# EAGLE design 452_spreakerRev102 (EAGLE 9.6.0)
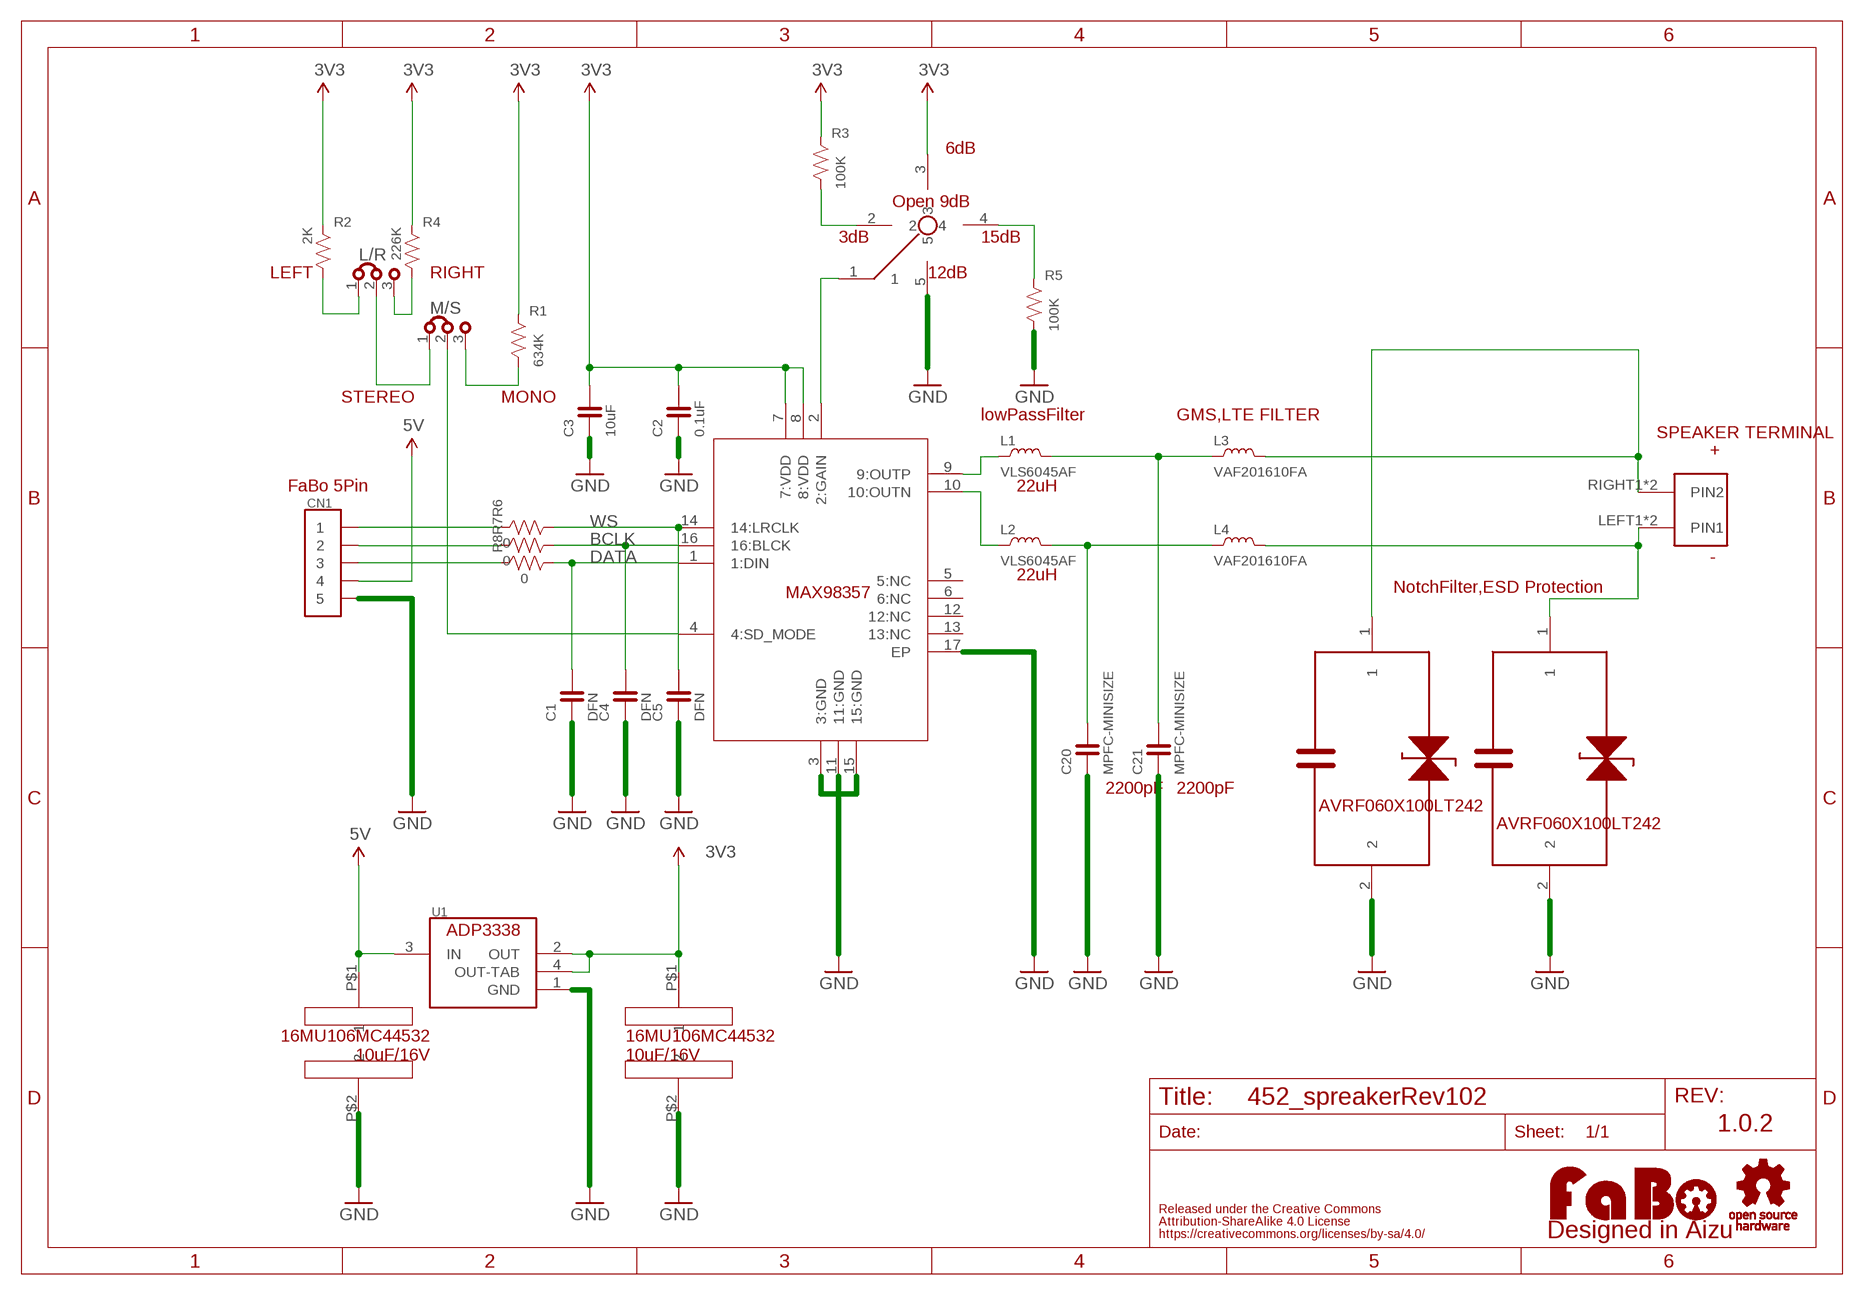
[diagram p0: schematic, sheet 1]

## Parts
C1  DFN  CAPACITOR-0603  [0603]
C2  0.1uF  CAPACITOR-0603  [0603]
C3  10uF  CAPACITOR-0603  [0603]
C4  DFN  CAPACITOR-0603  [0603]
C5  DFN  CAPACITOR-0603  [0603]
C20  MPFC-MINISIZE  [DIP-MPFC]
C21  MPFC-MINISIZE  [DIP-MPFC]
C100  POLIYMER_MULTI_LAYER_MU  [4532]
C101  POLIYMER_MULTI_LAYER_MU  [4532]
CN1  SMD-CONN-5PIN-SM05B-PASS-1  [SM05B-PASS-1]
L1  VLS6045AF  [VLS6045AF]
L2  VLS6045AF  [VLS6045AF]
L3  VAF201610FA  [VAF201610FA-1]
L4  VAF201610FA  [VAF201610FA-1]
L/R  JUMPERS_JP2-2MM  [JUMPERS_JP2-2MM]
LOGO1  LOGO_FABO-M  [LOGO_FABO_M]
M/S  JUMPERS_JP2-2MM  [JUMPERS_JP2-2MM]
R1  634K  RESISTOR-0603  [0603]
R2  2K  RESISTOR-0603  [0603]
R3  100K  RESISTOR-0603  [0603]
R4  226K  RESISTOR-0603  [0603]
R5  100K  RESISTOR-0603  [0603]
R6  0  RESISTOR-0603  [0603]
R7  0  RESISTOR-0603  [0603]
R8  0  RESISTOR-0603  [0603]
U1  ADP3338AKCZ  [SOT-223-KC3]
U$2  MAX98357A,B  [TQFN(16L3*3*0.75)]
U$3  2MMJUMPER_CROSS  [PINHEAD2MM_CROSS]
U$4  ML-1400-S1  [ML-1400-S1]
U$5  AVRF060X100LT242  [AVRF0X0X100LT_0603]
U$6  AVRF060X100LT242  [AVRF0X0X100LT_0603]
U$10  LOGO_OSHW-M_BOTTOM  [LOGO_OSHW_M_BOTTOM]

## Nets
3DB: R3.2 U$3.2
3V3: C2.2 C3.2 C101.P$1 R1.1 R2.1 R3.1 R4.1 U1.2(OUT) U1.4(OUT-TAB) U$2.7(7:VDD) U$2.8(8:VDD) U$3.3
5V: C100.P$1 CN1.4 U1.3(IN)
15DB: R5.1 U$3.4
BCLK: C4.2 R7.2 U$2.16(16:BLCK)
DATA: C1.2 R8.2 U$2.1(1:DIN)
GAIN: U$2.2(2:GAIN) U$3.1
GND: C1.1 C2.1 C3.1 C4.1 C5.1 C20.1 C21.1 C100.P$2 C101.P$2 CN1.5 R5.2 U1.1(GND) U$2.3(3:GND) U$2.11(11:GND) U$2.15(15:GND) U$2.17(EP) U$3.5 U$5.2 U$6.2
LEFT: L/R.1 R2.2
MONO: M/S.3 R1.2
MS: M/S.2 U$2.4(4:SD_MODE)
N$1: L2.1 U$2.10(10:OUTN)
N$2: L1.1 U$2.9(9:OUTP)
N$3: L4.2 U$4.LEFT1(PIN1) U$4.LEFT2(PIN1) U$6.1
N$5: CN1.1 R6.1
N$9: L3.2 U$4.RIGHT1(PIN2) U$4.RIGHT2(PIN2) U$5.1
N$12: CN1.2 R7.1
N$13: CN1.3 R8.1
N$14: C21.2 L1.2 L3.1
N$15: C20.2 L2.2 L4.1
RIGHT: L/R.3 R4.2
STEREO: L/R.2 M/S.1
WS: C5.2 R6.2 U$2.14(14:LRCLK)
Unconnected: U$2.5(5:NC) U$2.6(6:NC) U$2.12(12:NC) U$2.13(13:NC)

## Notes on the sheet
- 6dB
- Open 9dB
- 3dB | 15dB
- LEFT | RIGHT | 12dB
- STEREO | MONO
- lowPassFilter | GMS,LTE FILTER
- SPEAKER TERMINAL
- +
- FaBo 5Pin | 22uH
- -
- 22uH | NotchFilter,ESD Protection
- 2200pF | 2200pF
- AVRF060X100LT242
- AVRF060X100LT242
- 16MU106MC44532
  10uF/16V
- 16MU106MC44532
  10uF/16V
- 1.0.2

## Library data of the parts
C1-C5 = FaBo-Capacitor:CAPACITOR: CAPACITOR
C20 C21 = FaBo-Capacitor:MPFC-MINISIZE
C100 C101 = FaBo-Capacitor:POLIYMER_MULTI_LAYER_MU: Rubycon 16MU106MC44532 10uF/16V +-20% size 4532
CN1 = FaBo-Connetor:SMD-CONN-5PIN
L1 L2 = FaBo-Coil:VLS6045AF
L3 L4 = FaBo-Coil:VAF201610FA
L/R M/S = 52101-101-REV-A_v16:JUMPERS_JP2-: Jumper/Bridge
LOGO1 = component:LOGO_FABO
R1-R8 = FaBo-Resistors:RESISTOR: RESISTOR
U1 = FaBo-Supply:ADP3338AKCZ
U$2 = FaBo-AudioIC:MAX98357A,B
U$3 = FaBo-PIN:2MMJUMPER_CROSS
U$4 = FaBo-Terminal:ML-1400-S1
U$5 U$6 = FaBo-Coil:AVRF060X100LT242: ESD Notch Filters For wireless audio equipment TDK AVRF series ESD protection and noise protechtion.
U$10 = component:LOGO_OSHW

## Board
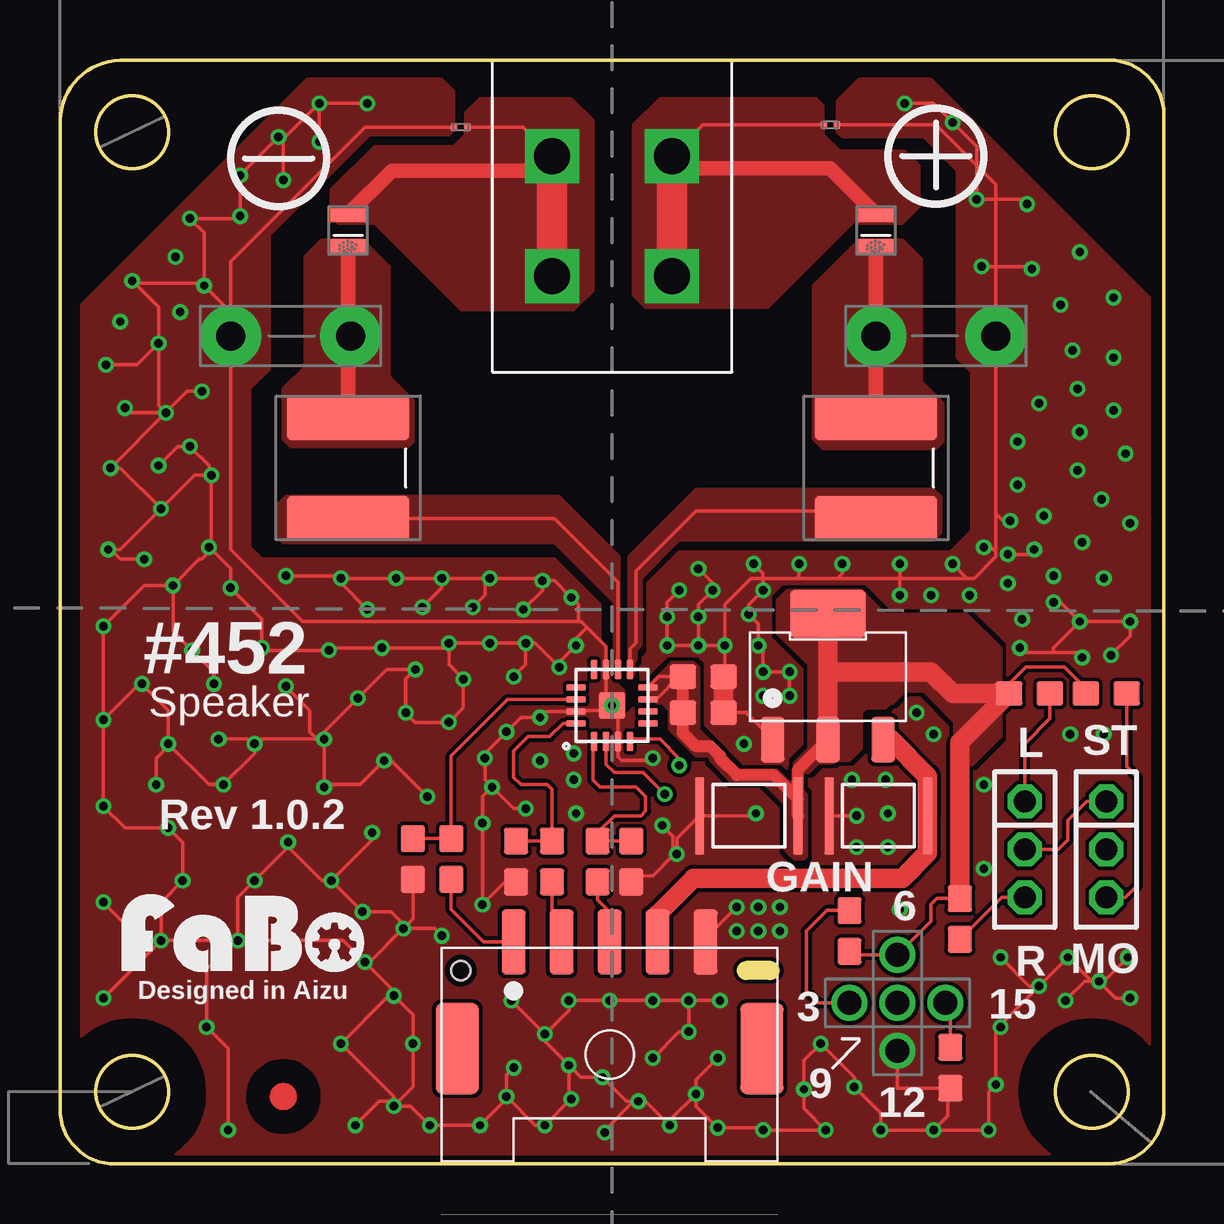
[diagram p1: board, top side]
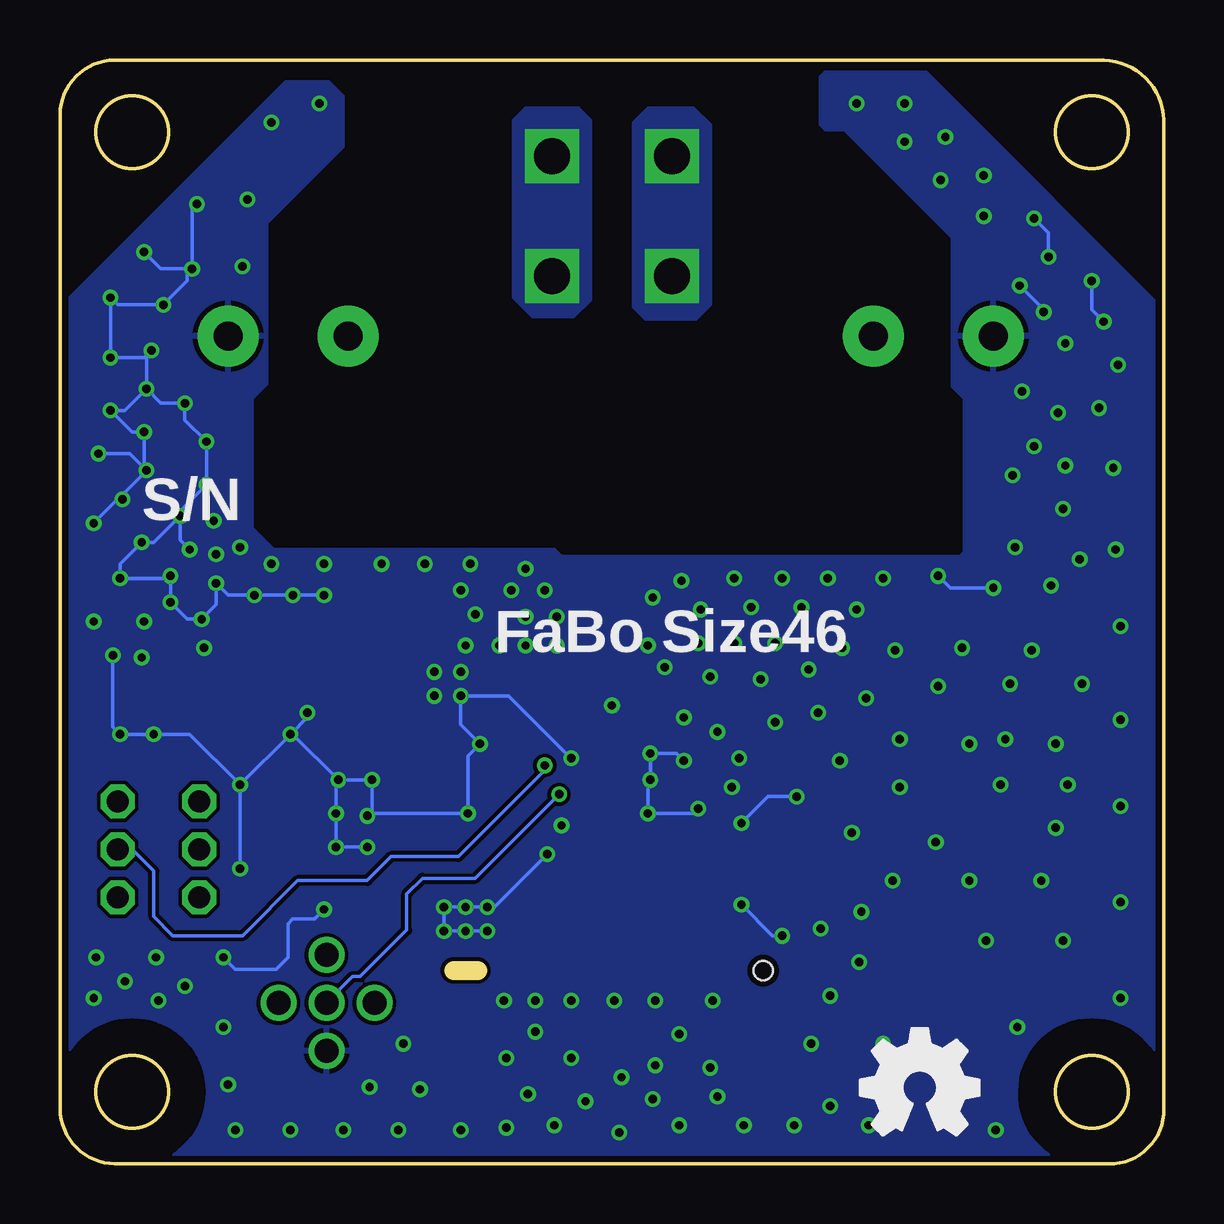
[diagram p2: board, bottom side, seen from below]

Size 46.02 x 46.02 mm. Coordinates in mm from the lower left corner, seen from the top.
Outline: 0.01,2.51 0.01,43.51 arc-87 2.51,46.01 43.51,46.01 arc-100 46.01,43.51 46.01,2.51 arc-99 43.51,0.01 2.51,0.01 arc-102 0.01,2.51
Outline: circle at 43.01,43.01 radius 1.5
Outline: circle at 3.01,43.01 radius 1.5
Outline: circle at 3.01,3.01 radius 1.5
Outline: circle at 43.01,3.01 radius 1.5
Copper layers (1*16): Top 0.035mm / dielectric 1.6mm / Bottom 0.035mm
Design rules "PCBway": minimum track width 6mil, minimum drill 12mil, track to track 6mil, track to pad 6mil, pad to pad 6mil, via to via 6mil, smd to smd 6mil, copper to edge 10mil, drill to drill 10mil, minimum pad ring 10mil, minimum via ring 6mil, stop-mask expansion 2mil, vias tented up to drill 100mil, thermal gap 8mil
tKeepout: area 27.9,32.4 to 30.6,46.6; area 40,40 to 46,46; area 0,40 to 6,46
tRestrict: area 0,0 to 6,6; area 40,0 to 46,6
bRestrict: area 0,0 to 6,6; area 40,0 to 46,6

### Footprints (pad centres in the part's own frame; a part is rotated, then mirrored left to right if it is on the bottom)
0603 = smd 1.1 x 1: 1 -0.85,0; 2 0.85,0
DIP-MPFC = drill 1.2 pad 2.54: 1 -2.5,0; 2 2.5,0
4532 = smd 0.4 x 3.2: P$1 2.05,0; P$2 -2.05,0
SM05B-PASS-1 = smd 1 x 2.7: 1 4,-11.85; 2 2,-11.85; 3 0,-11.85; 4 -2,-11.85; 5 -4,-11.85 | smd 1.8 x 3.8: P$1 6.35,-7.4; P$2 -6.35,-7.4 | hole 0.8: 6.2,-10.65
VLS6045AF = smd 1.9 x 5.1: 1 -2.1,0; 2 2.1,0
VAF201610FA-1 = smd 0.65 x 1.6: 1 -0.675,0; 2 0.675,0
JUMPERS_JP2-2MM = drill 0.914 octagon: 1 -2,0; 2 0,0; 3 2,0
SOT-223-KC3 = smd 1 x 1.9: 1 -2.3,-2.625; 2 0,-2.625; 3 2.3,-2.625 | smd 3.15 x 2: 4 0,2.625
TQFN(16L3*3*0.75) = smd 0.28 x 0.8: 1 -0.75,-1.5; 2 -0.25,-1.5; 3 0.25,-1.5; 4 0.75,-1.5; 9 0.75,1.5; 10 0.25,1.5; 11 -0.25,1.5; 12 -0.75,1.5 | smd 0.8 x 0.28: 5 1.5,-0.75; 6 1.5,-0.25; 7 1.5,0.25; 8 1.5,0.75; 13 -1.5,0.75; 14 -1.5,0.25; 15 -1.5,-0.25; 16 -1.5,-0.75 | smd 1.1 x 1.1: 17 0,0
PINHEAD2MM_CROSS = drill 1: 1 0,0; 2 -2,0; 3 0,2; 4 2,0; 5 0,-2
ML-1400-S1 = drill 1.5 square: LEFT1 -2.5,2.5; LEFT2 -2.5,-2.5; RIGHT1 2.5,2.5; RIGHT2 2.5,-2.5
AVRF0X0X100LT_0603 = smd 0.25 x 0.3: 1 -0.275,0; 2 0.275,0

### Placement (x,y rotation side)
C1  23.81,12.61 90 top
C2  26.81,20.31 180 top
C3  26.81,18.81 180 top
C4  19.01,12.61 90 top
C5  14.71,12.71 90 top
C20  9.61,34.51 0 top
C21  36.51,34.51 180 top
C100  34.11,14.51 0 top
C101  28.71,14.51 0 top
CN1  22.91,-2.59 180 top
L1  34.01,29.01 90 top
L2  12.01,29.01 90 top
L3  34.01,38.91 90 top
L4  12.01,38.91 90 top
L/R  40.21,13.11 270 top
LOGO1  7.63,7.63 0 top
M/S  43.61,13.11 270 top
R1  43.61,19.61 0 top
R2  40.41,19.61 0 top
R3  32.91,9.71 90 top
R4  37.51,10.21 270 top
R5  37.11,4.01 270 top
R6  16.31,12.71 90 top
R7  20.51,12.61 90 top
R8  22.41,12.61 90 top
U1  32.01,20.31 0 top
U$2  23.01,19.11 0 top
U$3  34.91,6.71 0 top
U$4  23.01,39.51 0 top
U$5  32.11,43.31 0 top
U$6  16.71,43.21 180 top
U$10  10.17,3.19 0 top
U$12  [MARK_POINT_3MM]  9.31,2.81 0 top

### Tracks (layer width: path | path; a pad name or v marks a point on that pad's centre or on a via)
3DB
  Top 0.152: R3.2 31.96,10.56 31.11,9.71 31.11,7.21 31.61,6.71 U$3.2
3V3
  Top 0.152: U$2.8 24.96,20.31 25.81,20.31 | 25.81,20.31 25.91,20.31 C2.2 | U$2.7 24.86,19.36 25.81,20.31 | 32.11,22.84 U1.4 | R3.1 33.06,8.71 U$3.3 36.31,10.11 36.31,10.81 36.56,11.06 R4.1 | R1.1 42.76,19.81 41.86,20.71 40.26,20.71 39.56,20.01 R2.1
  Top 0.508: U1.2 30.76,16.44 C101.P$1 30.76,15.21 29.76,16.21 28.21,16.21 27.51,16.91 27.51,17.01 27.11,17.41 26.51,17.41 25.96,17.96 C3.2 25.96,20.26 25.91,20.31
  Top 0.813: R4.1 37.51,17.56 R2.1 37.21,19.61 36.31,20.51 32.31,20.51 32.01,20.21 | U1.2 32.01,20.21 | 32.01,20.21 32.01,22.74 32.11,22.84
  pour Top (no thermals): 29.91,22.11 29.91,23.51 30.31,23.91 33.41,23.91 34.41,22.91 37.81,22.91 39.21,21.51 39.21,17.81 38.01,16.61 37.31,17.31 37.31,18.41 36.01,19.71 35.21,19.71 34.71,19.21 34.61,19.21 34.41,19.01 33.61,19.01 33.41,18.81 33.41,17.31 32.91,16.81 32.31,16.81 32.21,16.71 31.61,16.71 31.21,16.31 30.61,16.31 30.61,16.71 31.21,17.31 31.21,20.81
  pour Top (no thermals): 31.01,12.71 30.61,12.71 30.41,12.91 30.21,13.11 30.21,14.91 30.21,15.01 29.61,15.61 29.31,15.91 28.01,15.91 27.11,16.81 27.11,17.01 26.51,17.01 26.41,17.11 25.41,18.11 25.41,18.21 25.41,18.91 25.11,19.21 24.91,19.21 24.61,19.51 24.61,20.01 25.51,20.91 26.01,20.91 26.41,20.91 26.61,20.71 26.61,18.11 26.91,17.81 28.31,16.41 29.91,16.41 30.41,15.91 30.61,15.91 31.11,15.41 31.11,15.21 31.11,12.81
5V
  Top 0.813: CN1.4 24.91,10.41 26.41,11.91 35.11,11.91 36.16,12.96 C100.P$1 36.16,16.16 34.64,17.69 U1.3
15DB
  Top 0.152: R5.1 37.11,6.51 U$3.4
BCLK
  Top 0.152: C4.2 20.46,13.46 20.51,13.51 R7.2 20.51,15.61 20.31,15.81 19.21,15.81 18.91,16.11 18.91,17.21 19.51,17.81 20.41,17.81 20.96,18.36 U$2.16
DATA
  Top 0.152: U$2.1 22.21,17.56 22.21,16.01 22.51,15.71 24.01,15.71 24.41,15.31 24.41,14.71 24.21,14.51 23.11,14.51 22.41,13.81 R8.2 C1.2
GAIN  (via drill 0.35)
  Top 0.152: U$2.2 22.76,16.66 23.11,16.31 24.31,16.31 v25.21,15.41
  Bottom 0.152: v25.21,15.41 28.71,11.91 30.91,11.91 31.56,11.26 31.56,9.75 33.5,7.81 33.81,7.81 U$3.1
GND  (via drill 0.35)
  Top 0.152: 22.96,19.06 22.81,18.91 21.56,18.91 U$2.15 20.26,18.86 v20.01,18.61 19.21,18.61 v18.61,18.01 17.71,17.11 v17.71,16.91 17.71,16.01 v18.01,15.71 | 22.96,19.06 U$2.17 22.76,19.36 U$2.11 22.76,21.56 21.96,22.36 | v28.21,10.71 26.91,9.41 CN1.5 | C2.1 27.66,20.21 27.71,20.26 v27.71,21.61 | 22.96,19.06 23.26,18.76 U$2.3 23.26,16.96 23.41,16.81 24.61,16.81 v24.71,16.91 | 21.61,22.61 10.11,22.61 7.11,25.61 C20.1 7.11,35.71 | 21.61,22.61 21.71,22.61 21.96,22.36 | v27.71,21.61 27.71,23.31 28.81,24.41 29.31,24.41 | U$5.2 36.51,43.31 39.01,40.81 C21.1 39.01,27.11 | 7.11,35.71 7.11,37.61 12.71,43.21 U$6.2 | U$3.5 34.91,3.16 37.01,3.16 | 37.01,3.16 R5.2 | C1.1 24.06,12.01 24.71,12.01 25.56,12.86 | 25.56,12.86 25.61,12.91 v25.71,12.91 25.71,13.56 C101.P$2 28.91,14.51 v29.01,14.61 | 29.31,24.41 30.71,24.41 | 30.71,24.41 32.41,24.41 | 32.41,24.41 35.11,24.41 | 35.11,24.41 37.81,24.41 | 37.81,24.41 38.11,24.41 39.01,25.31 39.01,25.51 | 39.01,25.51 39.01,27.11 | v12.81,44.21 v10.81,44.21 | v10.81,44.21 9.41,42.81 v9.11,42.81 | v9.11,42.81 v7.51,41.21 v7.51,39.51 7.41,39.41 v5.41,39.41 6.01,38.81 6.01,36.71 | 6.01,36.71 v6.01,36.61 6.91,35.71 7.11,35.71 | 6.01,36.71 3.11,36.71 v3.01,36.81 4.11,35.71 v4.11,34.21 | v4.11,34.21 3.21,33.31 v1.91,33.31 | v4.11,34.21 4.11,31.61 v4.41,31.31 | v4.41,31.31 v2.11,29.01 2.51,29.01 v4.21,27.31 | 6.31,25.81 v6.31,28.71 6.21,28.71 | 6.31,25.81 v6.21,25.71 7.11,24.81 v7.11,24.01 8.41,22.71 v8.41,21.51 8.51,21.41 v11.21,21.41 11.31,21.51 v13.41,21.51 16.01,21.51 v16.21,21.71 | v4.21,27.31 5.61,28.71 6.21,28.71 | v4.21,27.31 2.51,25.61 2.11,25.61 | 2.11,25.61 v2.01,25.61
  Top 0.152: v4.71,24.11 3.51,24.11 v1.81,22.41 v1.81,18.51 | v1.81,18.51 v1.81,14.91 2.71,14.01 v4.51,14.01 5.11,13.41 v5.11,11.81 4.21,10.91 v4.21,9.31 | v1.81,10.91 3.41,9.31 v4.21,9.31 | v1.81,6.91 v4.21,9.31 | v4.21,9.31 7.31,9.31 | 7.31,9.31 v7.41,9.31 | v7.41,9.31 7.41,11.11 v8.11,11.81 9.51,13.21 | 9.51,13.21 v9.51,13.41 | v1.81,18.51 3.31,20.01 v3.41,20.01 4.51,18.91 v4.51,17.51 4.56,17.46 | v6.41,20.01 6.41,20.51 v5.51,21.41 4.71,22.21 v4.71,24.11 | v4.71,24.11 5.81,25.21 5.91,25.21 6.31,25.61 6.31,25.81 | 21.96,22.36 21.51,21.91 v21.51,21.61 20.81,20.91 v20.81,20.71 19.81,21.71 v19.41,21.71 19.41,21.61 | 21.61,22.61 21.61,23.31 v21.31,23.61 20.61,24.31 v20.11,24.31 | 19.41,21.61 19.41,20.81 v18.91,20.31 | 19.41,21.61 19.31,21.71 v17.91,21.71 v16.21,21.71 | v16.21,21.71 16.21,20.81 v16.81,20.21 16.81,19.01 v16.21,18.41 14.81,18.41 v14.41,18.81 14.41,20.21 v14.81,20.61 13.61,20.61 v12.41,19.41 11.01,18.01 v11.01,17.71 | v9.41,19.91 10.41,18.91 10.41,18.01 10.71,17.71 v11.01,17.71 | v11.01,17.71 8.31,17.71 v8.11,17.51 8.11,17.41 | 8.11,17.41 8.11,17.11 v6.81,15.81 6.21,15.81 4.56,17.46 | v11.01,17.71 11.01,15.81 | 11.01,15.81 v11.01,15.71 | 11.01,15.81 12.51,15.81 v13.51,16.81 13.81,16.81 v15.31,15.31 | v13.01,13.81 13.01,13.51 11.41,11.91 | 11.41,11.91 v11.31,11.81 10.91,11.81 9.51,13.21 | v18.01,15.71 17.61,15.31 v17.61,14.21 v17.61,10.81 18.56,11.76 C4.1 | v19.41,14.81 18.91,14.81 v18.01,15.71 | v14.31,9.81 14.41,9.91 | 14.41,9.91 14.71,10.21 C5.1 | 14.41,9.91 13.81,10.51 v12.61,10.51 11.41,11.71 11.41,11.91 | v14.31,9.81 15.61,9.81 v15.91,9.51 | v12.71,8.41 12.91,8.41 v14.31,9.81
  Top 0.152: v26.61,21.61 v25.31,21.61 v25.31,22.81 25.31,23.41 v25.81,23.91 | v26.61,21.61 v26.61,22.81 26.61,23.31 v27.21,23.91 27.21,24.21 v26.61,24.81 | v29.31,19.51 v30.41,19.51 v30.41,20.51 v29.31,20.51 29.31,21.41 v29.11,21.61 29.11,22.51 v28.71,22.91 28.71,23.31 v29.31,23.91 29.31,24.41 | C3.1 28.59,18.81 U1.1 | v7.01,1.41 7.01,4.81 v6.11,5.71 6.11,8.11 7.31,9.31 | v7.41,9.31 11.81,9.31 v12.71,8.41 | v12.71,8.41 13.91,7.21 v13.91,7.01 13.96,6.96 | 13.96,6.96 14.71,6.21 v14.71,5.01 14.71,3.21 v13.91,2.41 | 13.96,6.96 13.66,6.96 v11.71,5.01 13.91,2.81 13.91,2.61 | 13.91,2.61 v13.91,2.41 | v12.31,1.61 13.31,2.61 13.91,2.61 | v13.91,2.41 14.61,2.41 v15.41,1.61 v17.51,1.61 18.61,2.71 v18.61,2.81 | v18.61,2.81 18.61,3.71 v18.91,4.01 | v18.61,2.81 19.81,1.61 v20.21,1.61 v21.31,2.71 21.21,2.81 v21.21,4.11 | v21.21,4.11 20.21,5.11 v20.21,5.41 | v20.21,5.41 v18.81,6.81 | v20.21,5.41 21.21,6.41 v21.21,6.81 v22.91,6.81 v24.71,6.81 v26.21,6.81 26.31,6.81 | 26.31,6.81 v27.51,6.81 | 26.31,6.81 26.21,6.71 v26.21,5.51 25.81,5.51 v24.71,4.41 | v21.21,4.11 21.71,3.61 v22.61,3.61 23.61,2.61 23.91,2.61 | 23.91,2.61 v24.11,2.61 24.41,2.61 v25.41,1.61 25.41,1.81 v26.51,2.91 | v22.71,1.31 22.71,1.41 23.91,2.61 | v26.51,2.91 26.51,3.51 v27.41,4.41 | v26.51,2.91 26.51,2.41 v27.41,1.51 29.21,1.51 v29.31,1.41 v31.91,1.41 31.01,2.31 v31.01,3.11 31.01,4.31 v31.71,5.01 33.11,3.61 v33.11,3.21 34.21,2.11 v34.21,1.41 v36.41,1.41 36.51,1.51 | 36.51,1.51 37.01,2.01 37.01,3.16 | 36.51,1.51 36.61,1.41 v38.71,1.41 38.71,3.01 v39.01,3.31 39.01,5.51 v39.21,5.71 39.21,5.81 v40.81,7.41 | v40.81,7.41 40.41,7.41 v39.21,8.61
  Top 0.152: v40.81,7.41 v42.01,8.61 43.01,7.61 | 43.01,7.61 v43.31,7.61 | 43.01,7.61 42.71,7.61 v41.91,6.81 | v43.31,7.61 43.51,7.61 v44.51,8.61 | v43.31,7.61 44.01,6.91 v44.61,6.91 | v25.11,14.11 25.56,13.66 25.56,12.86 | v28.91,25.01 29.31,24.61 29.31,24.41 | v30.81,25.01 30.81,24.51 30.71,24.41 | v32.61,25.01 32.61,24.61 32.41,24.41 | v35.01,25.01 35.01,24.51 | 35.01,24.51 35.11,24.41 | v35.01,23.71 35.01,24.51 | v37.21,25.01 37.81,24.41 | v38.51,25.71 38.81,25.71 39.01,25.51 | v39.51,25.41 40.41,25.41 v40.61,25.61 | v39.61,26.81 39.31,26.81 39.01,27.11 | v42.61,21.11 42.61,21.31 41.41,21.31 | 41.41,21.31 41.41,21.51 v42.51,22.61 | v42.51,22.61 41.71,23.41 v41.41,23.41 | v44.61,22.61 44.61,22.41 | 44.61,22.41 44.61,22.01 v43.81,21.21 | v42.51,22.61 44.41,22.61 44.61,22.41 | v40.01,21.51 40.21,21.31 41.41,21.31 | v9.41,24.51 11.61,24.51 v11.71,24.41 | v11.71,24.41 v14.01,24.41 v15.91,24.41 | v15.91,24.41 17.71,24.41 | 17.71,24.41 v17.91,24.41 20.01,24.41 v20.11,24.31 | v12.81,23.11 11.71,24.21 v11.71,24.41 | v15.11,23.21 15.91,24.01 v15.91,24.41 | v17.21,23.21 17.71,23.71 17.71,24.41 | v19.31,23.11 20.11,23.91 v20.11,24.31 | v38.41,37.41 40.41,37.41 v40.51,37.31 | v40.31,40.01 40.11,40.21 v38.21,40.21 38.21,42.41 v37.21,43.41 36.41,44.21 v35.21,44.21 | v10.81,44.21 v10.81,42.61 | v9.11,42.81 9.31,42.61 v9.31,41.01 | v4.01,15.81 4.01,16.91 4.56,17.46 | v6.61,17.71 7.81,17.71 8.11,17.41 | v3.51,25.21 2.51,25.21 2.11,25.61 | v4.11,29.11 4.91,29.91 v5.41,29.91 6.21,29.11 6.21,28.71 | v4.41,31.31 2.91,31.31 v2.71,31.51 | v4.41,31.31 5.31,32.21 v5.91,32.21 | v33.21,14.51 C100.P$2 | v26.61,21.61 v27.71,21.61
  Top 0.813: C2.1 C3.1
  Bottom 0.152: v25.71,12.91 27.91,10.71 v28.21,10.71 v29.11,10.71 v30.01,10.71 v30.01,9.71 v29.11,9.71 v28.21,9.71 | v15.31,15.31 16.51,15.31 v17.61,14.21 | v15.91,9.51 16.31,9.51 v17.61,10.81 | v24.71,16.91 27.31,19.51 v29.31,19.51 29.31,18.31 v28.51,17.51 29.01,17.01 v29.01,14.61 33.11,14.61 v33.21,14.51 33.01,14.71 v33.01,16.01 v34.41,16.01 | v34.41,16.01 34.51,15.91 v34.51,14.61 v34.51,13.21 v33.21,13.21 | v35.01,10.61 35.41,10.21 36.31,10.21 36.51,10.01 36.51,8.61 37.01,8.11 38.71,8.11 v39.21,8.61 | v34.41,16.01 36.31,17.91 v36.41,17.91 | v36.41,17.91 35.71,18.61 v35.71,18.81 | v36.41,17.91 v38.51,15.81 | v38.51,15.81 v38.51,12.31 | v38.51,15.81 40.61,17.91 v42.11,17.91 v43.51,17.91 43.81,18.21 v43.81,21.21 | v20.01,16.81 20.31,17.11 v21.41,17.11 v21.41,16.01 21.51,15.91 v21.51,14.61 19.61,14.61 v19.41,14.81 | v40.31,40.01 40.51,39.81 v40.51,37.31 40.71,37.31 | 40.71,37.31 41.81,37.31 v42.51,38.01 | 40.71,37.31 40.71,36.81 v41.71,35.81 43.61,35.81 v43.91,36.11 v43.91,33.61 42.51,33.61 v42.21,33.91 42.41,33.71 v42.41,32.31 | v42.41,32.31 41.81,31.71 v40.81,31.71 40.81,31.01 v39.91,30.11 v39.91,28.31 41.01,27.21 v41.01,27.01 | v42.41,32.31 43.31,31.41 v43.91,31.41 43.01,30.51 v42.51,30.51 42.51,29.01 v42.41,28.91 | v42.41,28.91 43.11,29.61 v44.41,29.61 | v42.41,28.91 43.41,27.91 v43.41,27.71 43.61,27.71 v44.61,26.71 | v41.01,27.01 41.01,26.01 v40.61,25.61 | v41.01,27.01 42.11,25.91 v42.61,25.91 43.51,25.01 v43.51,24.41 41.51,24.41 | 41.51,24.41 v41.41,24.51 | 41.51,24.41 41.41,24.31 v41.41,23.41 40.71,22.71 v40.11,22.71 39.51,23.31 v39.51,24.21 39.01,23.71 v37.91,23.71 v36.31,23.71 v35.01,23.71
  Bottom 0.152: v9.41,24.51 8.91,24.01 v7.11,24.01 | v2.51,35.11 3.01,35.61 v3.01,36.81 | v4.81,37.81 4.81,38.81 v5.41,39.41 | v5.01,35.51 5.01,35.61 v6.01,36.61
  other vias: 23.01,19.11
  pour Top (rank 6, no thermals): 10.31,45.21 15.91,45.21 16.41,44.71 16.41,43.11 16.21,42.91 12.91,42.91 8.71,38.71 8.71,33.11 7.91,32.31 7.91,25.71 8.41,25.21 20.61,25.21 22.51,23.31 22.51,21.81 22.71,21.61 22.71,20.51 23.51,19.71 23.51,18.61 24.21,19.31 24.21,21.01 24.51,21.31 24.51,24.21 25.81,25.51 37.11,25.51 38.01,26.41 38.01,33.01 37.41,33.61 37.41,41.41 36.01,42.81 32.61,42.81 32.41,43.01 32.41,44.31 33.31,45.21 36.31,45.21 45.41,36.11 45.41,-0.69 45.11,-0.99 0.91,-0.99 0.91,35.81
  pour Bottom (rank 6): -0.69,34.91 9.91,45.51 14.11,45.51 14.31,45.31 14.31,43.31 14.11,43.11 13.31,43.11 8.81,38.61 8.81,32.41 8.31,31.91 8.31,25.51 8.51,25.31 25.11,25.31 25.41,25.61 37.11,25.61 38.01,26.51 38.01,31.91 37.41,32.51 37.41,39.21 34.21,42.41 34.21,44.51 34.81,45.11 36.61,45.11 45.71,36.01 45.71,-0.09 44.31,-1.49 2.41,-1.49 -0.69,1.61
LEFT
  Top 0.152: L/R.1 40.21,17.51 41.26,18.56 R2.2
MONO
  Top 0.152: R1.2 44.46,16.56 44.91,16.11 44.91,11.61 44.41,11.11 M/S.3
MS  (via drill 0.35)
  Top 0.152: v25.81,16.61 25.81,16.91 25.01,17.71 23.86,17.71 U$2.4
  Bottom 0.152: v25.81,16.61 25.81,16.41 29.41,12.81 32.21,12.81 33.21,11.81 36.11,11.81 38.41,9.51 41.31,9.51 42.11,10.31 42.11,12.21 43.01,13.11 M/S.2
N$1
  Top 0.152: L2.1 20.61,26.91 23.26,24.26 U$2.10
  pour Top (no thermals): 9.11,27.51 9.41,27.81 20.81,27.81 23.31,25.31 23.31,20.91 23.11,20.91 23.11,23.41 20.61,25.91 9.31,25.91 9.11,26.11
N$2
  Top 0.152: U$2.9 23.76,21.46 24.01,21.71 24.01,24.71 26.51,27.21 34.21,27.21 34.61,26.81 34.11,26.81 L1.1
  pour Top (no thermals): 23.71,20.41 23.71,25.31 26.51,28.11 36.41,28.11 36.71,27.81 36.71,26.31 36.41,26.01 25.81,26.01 24.21,24.41 24.21,21.61 24.01,21.41 24.01,21.01 23.91,20.91 23.91,20.41
N$3
  Top 0.152: U$6.1 19.31,43.21 U$4.LEFT1
  Top 0.61: L4.2 13.84,41.41 19.91,41.41 U$4.LEFT1
  Top 1.27: U$4.LEFT1 U$4.LEFT2
  pour Top (no thermals): 11.31,39.51 11.31,40.61 13.11,42.41 16.41,42.41 16.91,42.91 16.91,43.81 17.51,44.41 21.31,44.41 22.21,43.51 22.21,36.41 21.41,35.61 16.71,35.61 13.11,39.21 11.61,39.21
  pour Bottom (no thermals): 18.91,35.81 18.91,43.31 19.61,44.01 21.51,44.01 22.11,43.41 22.11,35.71 21.61,35.21 19.51,35.21
N$5
  Top 0.152: CN1.1 17.66,9.26 16.31,10.61 R6.1
N$9
  Top 0.152: U$5.1 26.81,43.31 U$4.RIGHT1
  Top 0.61: L3.2 32.09,41.51 26.01,41.51 U$4.RIGHT1
  Top 1.27: U$4.RIGHT1 U$4.RIGHT2
  pour Top (rank 6, no thermals): 23.91,36.21 23.91,43.31 25.01,44.41 31.51,44.41 31.81,44.11 31.81,42.91 32.51,42.21 35.21,42.21 35.81,41.61 35.81,39.91 35.11,39.21 33.21,39.21 33.11,39.31 29.51,35.71 24.41,35.71
  pour Bottom (no thermals): 24.61,35.31 23.91,36.01 23.91,43.51 24.41,44.01 26.61,44.01 27.11,43.51 27.11,36.11 26.31,35.31
N$12
  Top 0.152: CN1.2 20.51,9.66 R7.1
N$13
  Top 0.152: R8.1 22.41,11.01 22.91,10.51 CN1.3
N$14
  Top 0.61: L3.1 C21.2 L1.2
  pour Top (rank 6, no thermals): 31.41,30.21 31.41,36.61 33.31,38.51 35.11,38.51 35.91,37.71 35.91,32.61 36.81,31.71 36.81,30.11 36.51,29.81 31.81,29.81
N$15
  Top 0.61: L4.1 12.01,34.61 C20.2 12.01,34.41 L2.2
  pour Top (no thermals): 9.31,30.21 9.31,32.31 10.21,33.21 10.21,37.81 10.91,38.51 12.61,38.51 13.71,37.41 13.71,32.81 14.71,31.81 14.71,30.11 14.51,29.91 9.61,29.91
RIGHT
  Top 0.152: L/R.3 39.26,11.11 R4.2
STEREO
  Top 0.152: L/R.2 41.61,13.11 42.01,13.51 42.01,14.31 42.81,15.11 M/S.1
WS
  Top 0.152: U$2.14 18.66,19.36 16.31,17.01 R6.2 C5.2

### Text on the board
tPlace: #452 | Speaker | L | ST | Rev 1.0.2 | GAIN | 6 | R | MO | Designed in Aizu | 3 | 15 | 9 | 12
bPlace: S/N | FaBo Size46
tDocu: FaBo Brick New Size Type 46 / 寸法図 | R-2.5